# EAGLE design TinyCan (EAGLE 6.5.0)
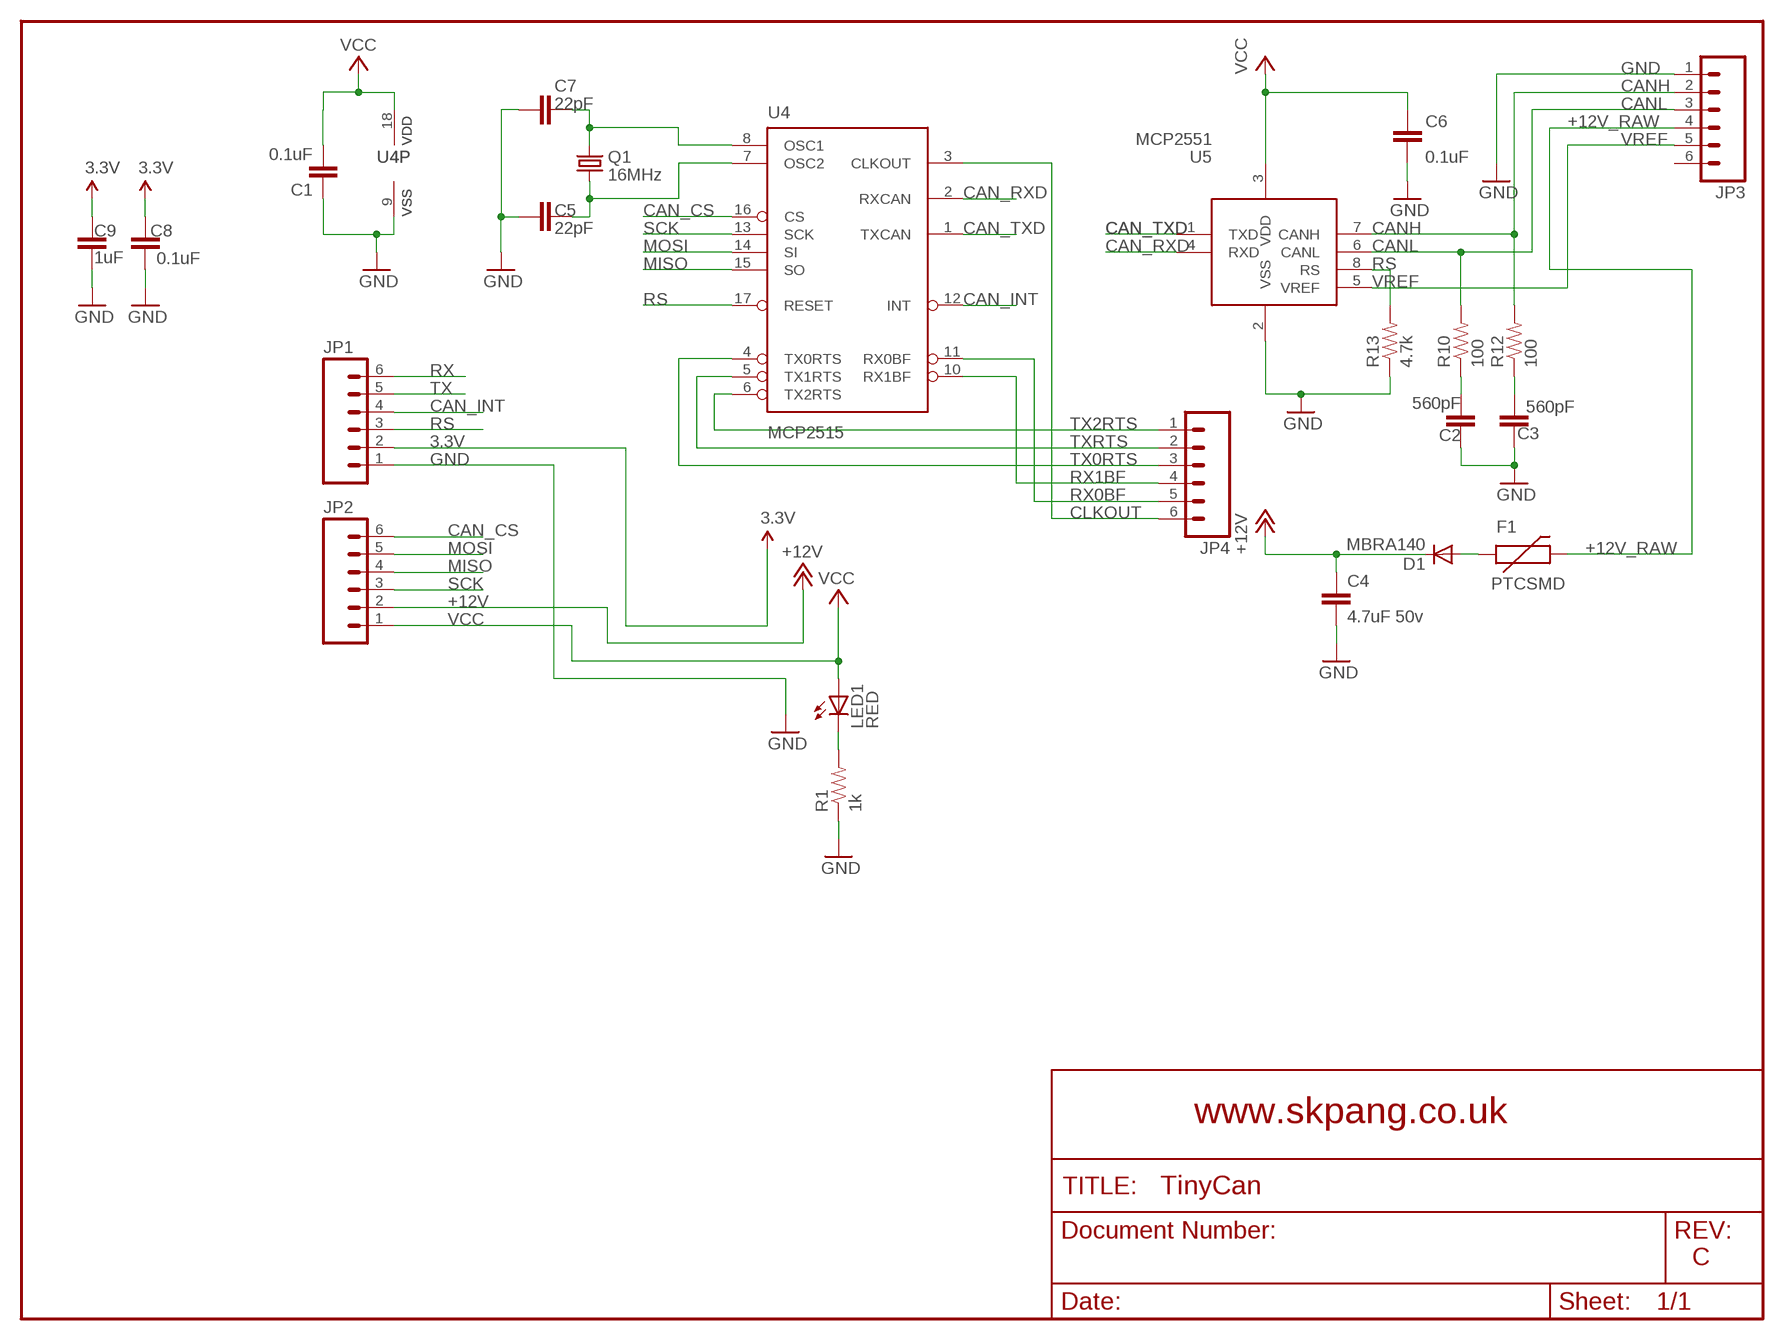
[diagram p0: schematic, sheet 1]

## Parts
C1  0.1uF  CAP0603-CAP  [0603-CAP]
C2  560pF  CAP0603-CAP  [0603-CAP]
C3  560pF  CAP0603-CAP  [0603-CAP]
C4  4.7uF 50v  CAP0603-CAP  [0603-CAP]
C5  22pF  CAP0603-CAP  [0603-CAP]
C6  0.1uF  CAP0603-CAP  [0603-CAP]
C7  22pF  CAP0603-CAP  [0603-CAP]
C8  0.1uF  CAP0603-CAP  [0603-CAP]
C9  1uF  CAP0603-CAP  [0603-CAP]
D1  MBRA140  DIODESMA  [SMA-DIODE]
F1  PTCSMD  [PTC-1206]
JP1  M06LOCK  [1X06_LOCK]
JP2  M06LOCK  [1X06_LOCK]
JP3  M06LOCK  [1X06_LOCK]
JP4  M06LOCK  [1X06_LOCK]
LED1  RED  LED0603  [LED-0603]
Q1  16MHz  CRYSTAL5X3  [CRYSTAL-SMD-5X3]
R1  1k  RESISTOR0603-RES  [0603-RES]
R10  100  RESISTOR0603-RES  [0603-RES]
R12  100  RESISTOR0603-RES  [0603-RES]
R13  4.7k  RESISTOR0603-RES  [0603-RES]
U4  MCP2515  MCP2510SO  [SO-18W]
U5  MCP2551  [SO-08M]

## Nets
3.3V: C8.2 C9.1 JP1.2
+12V: C4.1 D1.C JP2.2
+12V_RAW: F1.2 JP3.4
CAN_CS: JP2.6 U4.16(CS)
CAN_INT: JP1.4 U4.12(INT)
CAN_RXD: U4.2(RXCAN) U5.4(RXD)
CAN_TXD: U4.1(TXCAN) U5.1(TXD)
CANH: JP3.2 R12.2 U5.7(CANH)
CANL: JP3.3 R10.2 U5.6(CANL)
CLKOUT: JP4.6 U4.3(CLKOUT)
GND: C1.1 C2.1 C3.1 C4.2 C5.1 C6.1 C7.1 C8.1 C9.2 JP1.1 JP3.1 R1.1 R13.1 U4.9(VSS) U5.2(VSS)
MISO: JP2.4 U4.15(SO)
MOSI: JP2.5 U4.14(SI)
N$4: LED1.C R1.2
N$9: C2.2 R10.1
N$10: C3.2 R12.1
N$16: D1.A F1.1
N$17: C7.2 Q1.3 U4.8(OSC1)
N$18: C5.2 Q1.1 U4.7(OSC2)
RS: JP1.3 R13.2 U4.17(RESET) U5.8(RS)
RX: JP1.6
RX0BF: JP4.5 U4.11(RX0BF)
RX1BF: JP4.4 U4.10(RX1BF)
SCK: JP2.3 U4.13(SCK)
TX: JP1.5
TX0RTS: JP4.3 U4.4(TX0RTS)
TX2RTS: JP4.1 U4.6(TX2RTS)
TXRTS: JP4.2 U4.5(TX1RTS)
VCC: C1.2 C6.2 JP2.1 LED1.A U4.18(VDD) U5.3(VDD)
VREF: JP3.5 U5.5(VREF)
Unconnected: JP3.6

## Notes on the sheet
- www.skpang.co.uk
- C

## Library data of the parts
C1-C9 = SparkFun:CAP: Capacitor Standard 0603 ceramic capacitor, and 0.1" leaded capacitor.
D1 = SparkFun:DIODE: Diode These are standard reverse protection diodes and small signal diodes. SMA package can handle up to about 1A. SOD-323 can handle about 200mA. What the SOD-323 package when ordering, there are some mfgs out there that are 5-pin packages.
F1 = SparkFun:PTC: Resettable Fuse PTC Resettable Fuse. Spark Fun Electronics SKU : COM-08357
JP1-JP4 = SparkFun-Connectors:M06: Header 6 Standard 6-pin 0.1" header. Use with straight break away headers (SKU : PRT-00116), right angle break away headers (PRT-00553), swiss pins (PRT-00743), machine pins (PRT-00117), and female headers (PRT-00115). Molex polarized connector foot print use with SKU : PRT-08094 with associated crimp pins and housings. NOTES ON THE VARIANTS LOCK and LOCK_LONGPADS... This footprint was designed to help hold the alignment of a through-hole component (i.e. 6-pin header) while soldering it into place. You may notice that each hole has been shifted either up or down by 0.005 of an inch from it's more standard position (which is a perfectly straight line). This slight alteration caused the pins (the squares in the middle) to touch the edges of the holes. Because they are alternating, it causes a "brace" to hold the component in place. 0.005 has proven to be the perfect amount of "off-center" position when using our standard breakaway headers. Although looks a little odd when you look at the bare footprint, once you have a header in there, the alteration is very hard to notice. Also,if you push a header all the way into place, it is covered up entirely on the bottom side. This idea of altering the position of holes to aid alignment will be further integrated into the Sparkfun Library for other footprints. It can help hold any component with 3 or more connection pins.
LED1 = SparkFun:LED: LEDs Standard schematic elements and footprints for 5mm, 3mm, 1206, and 0603 sized LEDs. 5mm - Spark Fun Electronics SKU : COM-00529 (and others)
Q1 = SparkFun:CRYSTAL: Crystals Various standard crystals. Proven footprints. Spark Fun Electronics SKU : COM-00534
R1 R10 R12 R13 = SparkFun:RESISTOR: Resistor Basic schematic elements and footprints for 0603, 1206, and PTH resistors.
U4 = microchip_can:MCP2510
U5 = skpang_lib:MCP2551

## Board
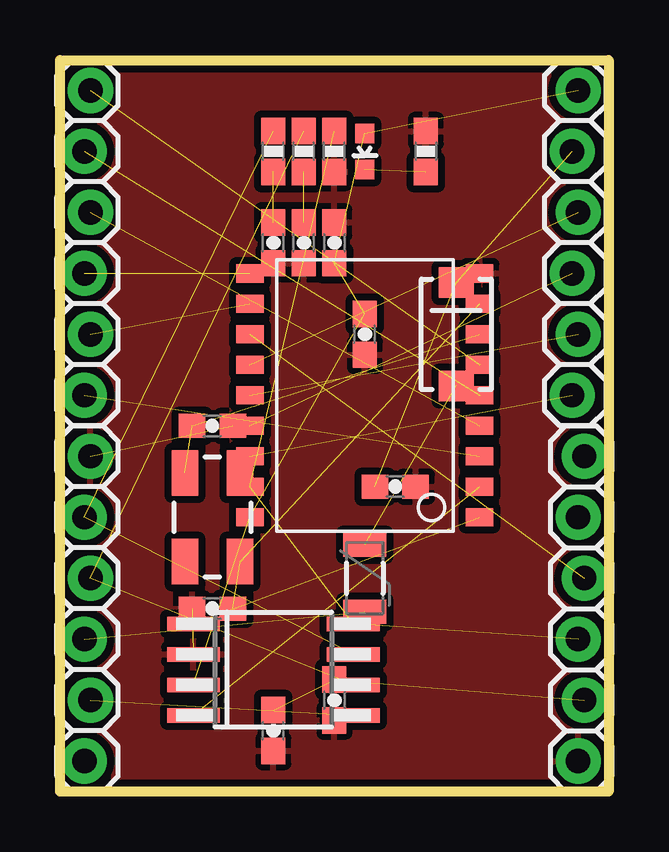
[diagram p1: board, top side]
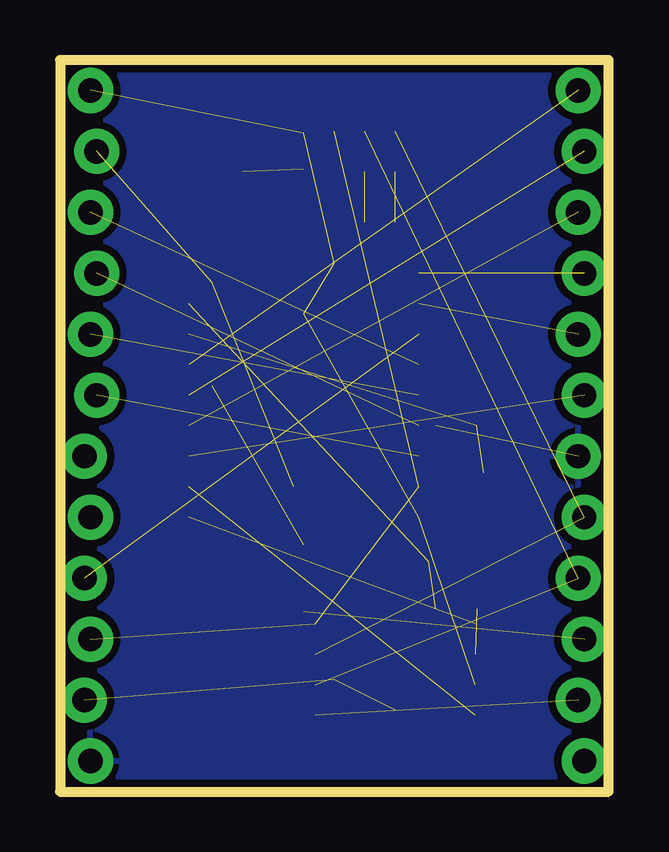
[diagram p2: board, bottom side, seen from below]

Size 22.86 x 30.48 mm. Coordinates in mm from the lower left corner, seen from the top.
Outline: 0,0 0,30.48 22.86,30.48 22.86,0 0,0
Copper layers (1*16): Top 0.035mm / dielectric 1.5mm / Bottom 0.035mm
Design rules "SparkFun": minimum track width 8mil, minimum drill 20mil, track to track 8mil, track to pad 8mil, pad to pad 8mil, via to via 8mil, smd to smd 8mil, copper to edge 8mil, drill to drill 8mil, minimum pad ring 12mil, minimum via ring 10mil, stop-mask expansion 4mil, vias tented up to drill 20mil, thermal gap 10mil

### Footprints (pad centres in the part's own frame; a part is rotated, then mirrored left to right if it is on the bottom)
0603-CAP = smd 1.1 x 1: 1 -0.85,0; 2 0.85,0
SMA-DIODE = smd 1.27 x 1.47: A -2.15,0; C 2.15,0
PTC-1206 = smd 1 x 1.8: 1 -1.4,0; 2 1.4,0
1X06_LOCK = drill 1.016 pad 1.88: 1 0,0; 2 2.54,-0.254; 3 5.08,0; 4 7.62,-0.254; 5 10.16,0; 6 12.7,-0.254
LED-0603 = smd 0.8 x 0.8: A 0,-0.75; C 0,0.75
CRYSTAL-SMD-5X3 = smd 1.9 x 1.1: 1 -1.85,-1.15; 2 1.85,-1.15; 3 1.85,1.15; 4 -1.85,1.15
0603-RES = smd 1.1 x 1: 1 -0.85,0; 2 0.85,0
SO-18W = smd 0.762 x 1.143: 1 -5.08,-4.788; 2 -3.81,-4.788; 3 -2.54,-4.788; 4 -1.27,-4.788; 5 0,-4.788; 6 1.27,-4.788; 7 2.54,-4.788; 8 3.81,-4.788; 9 5.08,-4.788; 10 5.08,4.788; 11 3.81,4.788; 12 2.54,4.788; 13 1.27,4.788; 14 0,4.788; 15 -1.27,4.788; 16 -2.54,4.788; 17 -3.81,4.788; 18 -5.08,4.788
SO-08M = smd 0.6 x 2.2: 1 -1.905,-3.33; 2 -0.635,-3.33; 3 0.635,-3.33; 4 1.905,-3.33; 5 1.905,3.33; 6 0.635,3.33; 7 -0.635,3.33; 8 -1.905,3.33

### Placement (x,y rotation side)
C1  12.7,19.05 90 top
C2  10.16,22.86 90 top
C3  8.89,22.86 90 top
C4  13.97,12.7 0 top
C5  6.35,15.24 180 top
C6  11.43,22.86 270 top
C7  6.35,7.62 0 top
C8  8.89,2.54 90 top
C9  11.43,3.81 270 top
D1  16.51,19.05 90 top
F1  12.7,8.89 270 top
JP1  21.59,1.27 90 top
JP2  21.59,29.21 270 top
JP3  1.27,13.97 270 top
JP4  1.27,29.21 270 top
LED1  12.7,26.67 180 top
Q1  6.35,11.43 270 top
R1  15.24,26.67 270 top
R10  10.16,26.67 90 top
R12  8.89,26.67 90 top
R13  11.43,26.67 90 top
U4  12.7,16.51 90 top
U5  8.89,5.08 270 top

### Tracks (layer width: path | path; a pad name or v marks a point on that pad's centre or on a via)
3.3V  (2 unrouted)
+12V  (2 unrouted)
+12V_RAW  (1 unrouted)
CAN_CS  (1 unrouted)
CAN_INT  (1 unrouted)
CAN_RXD  (1 unrouted)
CAN_TXD  (1 unrouted)
CANH  (2 unrouted)
CANL  (2 unrouted)
CLKOUT  (1 unrouted)
GND  (2 unrouted)
  pour Bottom (isolate 0.305): 0,0 0,30.48 22.86,30.48 22.86,0
  pour Top (isolate 0.305): 0,0 0,30.48 22.86,30.48 22.86,0
MISO  (1 unrouted)
MOSI  (1 unrouted)
N$4  (1 unrouted)
N$9  (1 unrouted)
N$10  (1 unrouted)
N$16  (1 unrouted)
N$17  (2 unrouted)
N$18  (2 unrouted)
RS  (3 unrouted)
RX0BF  (1 unrouted)
RX1BF  (1 unrouted)
SCK  (1 unrouted)
TX0RTS  (1 unrouted)
TX2RTS  (1 unrouted)
TXRTS  (1 unrouted)
VCC  (5 unrouted)
VREF  (1 unrouted)